# EAGLE schematic timer2 (EAGLE 9.0.1)
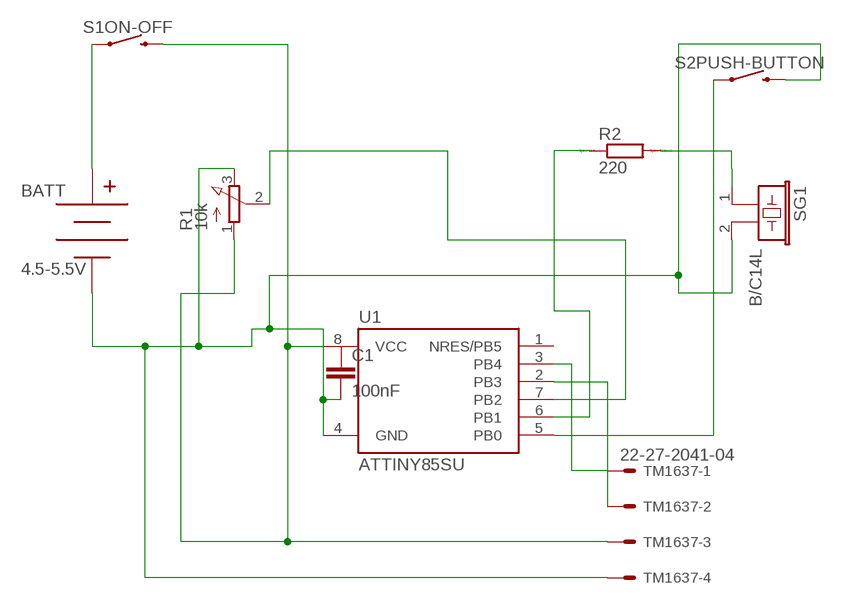
[diagram p0: schematic, sheet 1]

## Parts
BATT  4.5-5.5V  BC9VPC  [BC9VPC]
C1  100nF  C-EU025-024X044  [C025-024X044]
R1  10k  3RP/1610N  [3RP/1610N]
R2  220  R0204/7  [0204/7]
S1ON-OFF  MOMENTARY-SWITCH-SPST-PTH-6.0MM  [TACTILE_SWITCH_PTH_6.0MM]
S2PUSH-BUTTON  MOMENTARY-SWITCH-SPST-PTH-6.0MM  [TACTILE_SWITCH_PTH_6.0MM]
SG1  B/C14L  [B/C14L]
TM1637  22-27-2041-04  [6410-04]
U1  ATTINY85SU  [ATTINY85]

## Nets
N$1: BATT.V+ S1ON-OFF.1
N$3: BATT.V- C1.2 R1.3(E) S2PUSH-BUTTON.3 SG1.2 TM1637.4 U1.4(GND)
N$4: R2.2 SG1.1
N$6: S2PUSH-BUTTON.1 U1.5(PB0)
N$7: R2.1 U1.6(PB1)
N$8: R1.2(S) U1.7(PB2)
N$9: TM1637.1 U1.3(PB4)
N$10: TM1637.2 U1.2(PB3)
N$12: R1.1(A) S1ON-OFF.3 TM1637.3 U1.8(VCC)
Unconnected: C1.1 U1.1(NRES/PB5)

## Library data of the parts
BATT = SparkFun-Connectors:BC9VPC: 9V Battery Holder - PC Mount Standard and Kit footprints included SparkFun Products: SparkFun SparkPunk Sound Kit <https://www.sparkfun.com/products/11177> SparkFun SparkPunk Sequencer Kit <https://www.sparkfun.com/products/12707>; PROD_ID: BATT-10855
C1 = resistor:C-EU: CAPACITOR, European symbol
R1 = pot:3RP/1610N: 16mm Potentiometer one level Source: http://www.alphapotentiometers.net/html/16mm_pot_2.html
R2 = eagle-ltspice:R: RESISTOR, European symbol; SPICEMODEL: NONE; SPICEPREFIX: R
S1ON-OFF S2PUSH-BUTTON = SparkFun-Switches:MOMENTARY-SWITCH-SPST: Momentary Switch (Pushbutton) - SPST Normally-open (NO) SPST momentary switches (buttons, pushbuttons). Variants PTH-12MM - 12mm square, through-hole Momentary Pushbutton Switch - 12mm Square <https://www.sparkfun.com/products/9190> (COM-09190) PTH-6.0MM, PTH-6.0MM-KIT - 6.0mm square, through-hole Mini Pushbutton Switch <https://www.sparkfun.com/products/97> (COM-00097) KIT package intended for soldering kit's - only one side of pads' copper is exposed. PTH-RIGHT-ANGLE-KIT - Right-angle, through-hole Right Angle Tactile Button <https://www.sparkfun.com/products/10791> - Used on SparkFun BigTime Watch Kit <https://www.sparkfun.com/products/11734> SMD-12MM - 12mm square, surface-mount Tactile Button - SMD (12mm) <https://www.sparkfun.com/products/12993> (COM-12993) Used on SparkFun PicoBoard <https://www.sparkfun.com/products/11888> SMD-4.5MM - 4.5mm Square Trackball Switch Used on SparkFun Blackberry Trackballer Breakout <https://www.sparkfun.com/products/13169> SMD-4.6MMX2.8MM - 4.60mm x 2.80mm, surface mount Used on SparkFun SAMD21 Mini Breakout <https://www.sparkfun.com/products/13664> SMD-5.2MM, SMD-5.2-REDUNDANT - 5.2mm square, surface-mount Mini Pushbutton Switch - SMD <https://www.sparkfun.com/products/8720> (COM-08720) Used on Arduino Pro Mini <https://www.sparkfun.com/products/11114> REDUNDANT package connects both switch circuits together SMD-6.0X3.5MM - 6.0 x 3.5mm, surface mount Momentary Reset Switch SMD <https://www.sparkfun.com/products/8229> (COM-08229) SMD-6.2MM-TALL - 6.2mm square, surface mount Tactile Button - SMD (6mm) <https://www.sparkfun.com/products/12992> Used on SparkFun Digital Sandbox <https://www.sparkfun.com/products/12651> SMD-RIGHT-ANGLE - Right-angle, surface mount Used on SparkFun Block for Intel® Edison - Arduino <https://www.sparkfun.com/products/13036>; PROD_ID: SWCH-08441; SF_SKU: COM-00097
SG1 = buzzer:B/C14L: BUZZER Source: Buerklin; OC_FARNELL: unknown; OC_NEWARK: unknown
TM1637 = con-molex:22-?-04: CONNECTOR wire to board 2.54 mm (.1 inch) pitch header; MF: MOLEX; OC_FARNELL: unknown; OC_NEWARK: unknown
U1 = attiny85:ATTINY85: ATMEL ATtiny 85